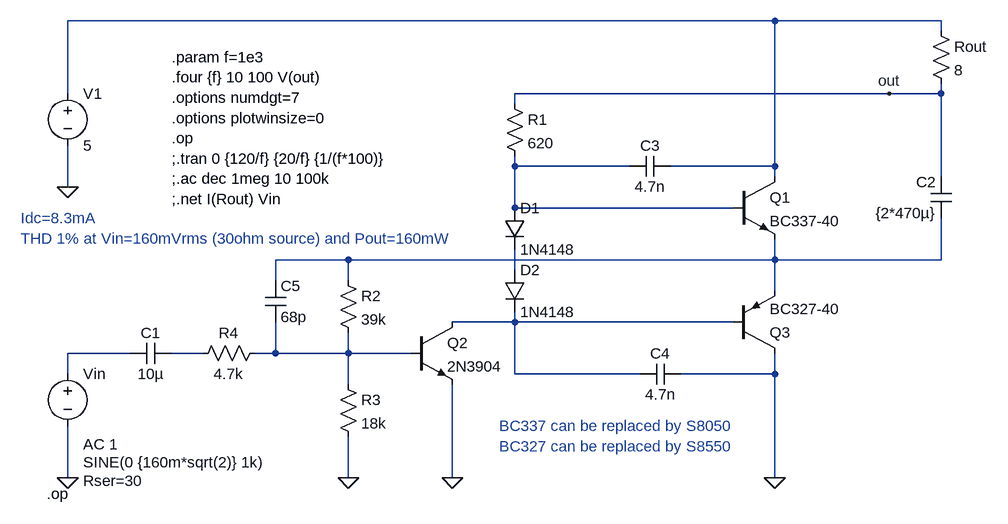
[diagram p0: schematic onetransistor.eu_5V.asc]
onetransistor.eu_5V.asc, the LTspice schematic file:
Version 4
SHEET 1 1464 680
WIRE 528 -176 -560 -176
WIRE 784 -176 528 -176
WIRE 784 -160 784 -176
WIRE -560 -64 -560 -176
WIRE 704 -64 128 -64
WIRE 784 -64 784 -80
WIRE 784 -64 704 -64
WIRE 128 -48 128 -64
WIRE 128 48 128 32
WIRE 304 48 128 48
WIRE 528 48 528 -176
WIRE 528 48 368 48
WIRE 528 64 528 48
WIRE 784 64 784 -64
WIRE -560 80 -560 16
WIRE 128 112 128 48
WIRE 464 112 128 112
WIRE -128 192 -240 192
WIRE 528 192 528 160
WIRE 528 192 -128 192
WIRE 784 192 784 128
WIRE 784 192 528 192
WIRE 128 208 128 176
WIRE -240 224 -240 192
WIRE -128 224 -128 192
WIRE 528 240 528 192
WIRE 128 288 128 272
WIRE 128 288 32 288
WIRE 464 288 128 288
WIRE -464 336 -560 336
WIRE -352 336 -400 336
WIRE -240 336 -240 288
WIRE -240 336 -272 336
WIRE -128 336 -128 304
WIRE -128 336 -240 336
WIRE -32 336 -128 336
WIRE -560 368 -560 336
WIRE 128 368 128 288
WIRE 320 368 128 368
WIRE 528 368 528 336
WIRE 528 368 384 368
WIRE -128 384 -128 336
WIRE -560 528 -560 448
WIRE -128 528 -128 464
WIRE 32 528 32 384
WIRE 528 528 528 368
FLAG -560 80 0
FLAG -560 528 0
FLAG -128 528 0
FLAG 32 528 0
FLAG 528 528 0
FLAG 704 -64 out
DATAFLAG 352 192 ""
DATAFLAG 352 -64 ""
DATAFLAG 336 288 ""
DATAFLAG 352 112 ""
DATAFLAG -80 336 ""
SYMBOL npn 464 64 R0
SYMATTR InstName Q1
SYMATTR Value BC337-40
SYMBOL npn -32 288 R0
SYMATTR InstName Q2
SYMATTR Value 2N3904
SYMBOL pnp 464 336 M180
SYMATTR InstName Q3
SYMATTR Value BC327-40
SYMBOL diode 112 112 R0
SYMATTR InstName D1
SYMATTR Value 1N4148
SYMBOL diode 112 208 R0
SYMATTR InstName D2
SYMATTR Value 1N4148
SYMBOL res 112 -64 R0
SYMATTR InstName R1
SYMATTR Value 620
SYMBOL res -144 208 R0
SYMATTR InstName R2
SYMATTR Value 39k
SYMBOL res -144 368 R0
SYMATTR InstName R3
SYMATTR Value 18k
SYMBOL res -256 320 R90
WINDOW 0 0 56 VBottom 2
WINDOW 3 32 56 VTop 2
SYMATTR InstName R4
SYMATTR Value 4.7k
SYMBOL voltage -560 -80 R0
SYMATTR InstName V1
SYMATTR Value 5
SYMBOL cap -400 320 R90
WINDOW 0 0 32 VBottom 2
WINDOW 3 32 32 VTop 2
SYMATTR InstName C1
SYMATTR Value 10µ
SYMBOL cap 800 128 R180
WINDOW 0 24 56 Left 2
WINDOW 3 24 8 Left 2
SYMATTR InstName C2
SYMATTR Value {2*470µ}
SYMBOL res 768 -176 R0
SYMATTR InstName Rout
SYMATTR Value 8
SYMBOL voltage -560 352 R0
WINDOW 3 24 152 Left 2
WINDOW 123 24 124 Left 2
WINDOW 39 24 180 Left 2
SYMATTR Value SINE(0 {160m*sqrt(2)} 1k)
SYMATTR Value2 AC 1
SYMATTR SpiceLine Rser=30
SYMATTR InstName Vin
SYMBOL cap -256 224 R0
SYMATTR InstName C5
SYMATTR Value 68p
SYMBOL cap 368 32 R90
WINDOW 0 0 32 VBottom 2
WINDOW 3 32 32 VTop 2
SYMATTR InstName C3
SYMATTR Value 4.7n
SYMBOL cap 384 352 R90
WINDOW 0 0 32 VBottom 2
WINDOW 3 32 32 VTop 2
SYMATTR InstName C4
SYMATTR Value 4.7n
TEXT -592 552 Left 2 !.op
TEXT -400 -120 Left 2 !.param f=1e3\n.four {f} 10 100 V(out)\n.options numdgt=7\n.options plotwinsize=0\n.op\n;.tran 0 {120/f} {20/f} {1/(f*100)}\n;.ac dec 1meg 10 100k\n;.net I(Rout) Vin
TEXT -632 128 Left 2 ;Idc=8.3mA\nTHD 1% at Vin=160mVrms (30ohm source) and Pout=160mW
TEXT 104 448 Left 2 ;BC337 can be replaced by S8050\nBC327 can be replaced by S8550

The netlist it stands for:
* onetransistor.eu_5V.asc
Q1 N001 N002 N003 0 BC337-40
Q2 N005 N008 0 0 2N3904
Q3 0 N005 N003 0 BC327-40
D1 N002 N004 1N4148
D2 N004 N005 1N4148
R1 out N002 620
R2 N003 N008 39k
R3 N008 0 18k
R4 N008 N007 4.7k
V1 N001 0 5
C1 N007 N006 10µ
C2 N003 out {2*470µ}
Rout N001 out 8
Vin N006 0 SINE(0 {160m*sqrt(2)} 1k) AC 1 Rser=30
C5 N003 N008 68p
C3 N001 N002 4.7n
C4 0 N005 4.7n
.model D D
.lib standard.dio
.model NPN NPN
.model PNP PNP
.lib standard.bjt
.op
.param f=1e3
.four {f} 10 100 V(out)
.options numdgt=7
.options plotwinsize=0
.op
;.tran 0 {120/f} {20/f} {1/(f*100)}
;.ac dec 1meg 10 100k
;.net I(Rout) Vin
* Idc=8.3mA
* THD 1% at Vin=160mVrms (30ohm source) and Pout=160mW
* BC337 can be replaced by S8050
* BC327 can be replaced by S8550
.backanno
.end